# Altium schematic sheet Display_LCD16x2.SchDoc
size 116 x 109 mm
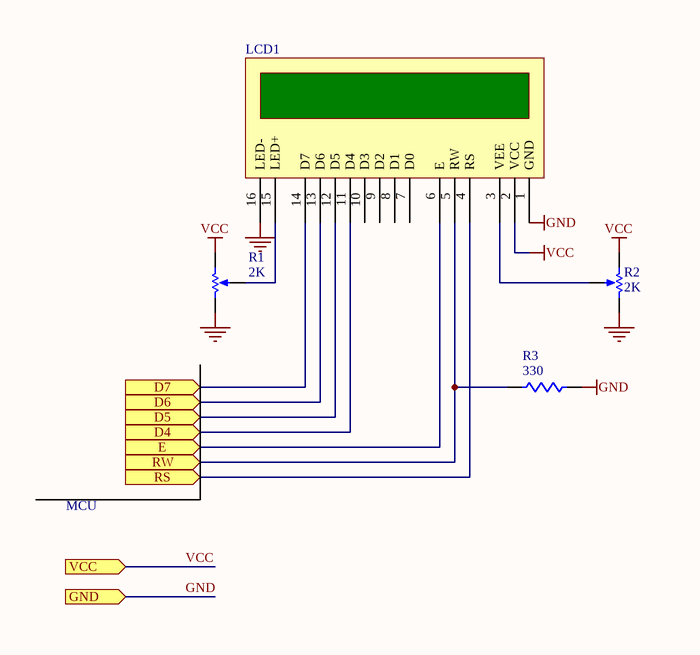
[diagram p0: Display_LCD16x2.SchDoc]

## Parts
LCD1  LCD_16*2  [LCD_2x16]  (value not drawn)
R1  value 2K  [VR8-5/5.6MM]  (hidden comment: RPot1)
R2  value 2K  [VR8-5/5.6MM]  (hidden comment: RPot1)
R3  value 330  [AXIAL-0.4]  (hidden comment: Res1)

## Ports
D4 (in), D5 (in), D6 (in), D7 (in), E (in), GND, RS (in), RW (in), VCC

## Nets
GND: LCD1.1(GND) LCD1.16(LED-) R1.2(BOT) R2.1(TOP) R3.1 ; port GND
VCC: LCD1.2(VCC) R1.1(TOP) R2.2(BOT) ; port VCC
D4: LCD1.11(D4) ; port D4
D5: LCD1.12(D5) ; port D5
D6: LCD1.13(D6) ; port D6
D7: LCD1.14(D7) ; port D7
E: LCD1.6(E) ; port E
RS: LCD1.4(RS) ; port RS
RW: LCD1.5(RW) R3.2 ; port RW
NetLCD1_3: LCD1.3(VEE) R2.3(TAP)
NetLCD1_15: LCD1.15(LED+) R1.3(TAP)

Not connected (* = marked no-connect by the designer): LCD1 7(D0) 8(D1) 9(D2) 10(D3)

## Notes on the sheet
- MCU

## Library data of the parts
R1 R2 = RPot1: Potentiometer; Manufacturer: Generic Components; Class I: Passive; Set Position: 0.5; Published: 8-Jun-2000; Revision: July-2002: Re-released for DXP Platform.; Publisher: Altium Limited; Class II: Potentiometer
R3 = Res1: Resistor; Manufacturer: Generic Components; Class I: Passive; Published: 8-Jun-2000; Revision: July-2002: Re-released for DXP Platform.; Publisher: Altium Limited; Class II: Resistor